# Altium schematic sheet Bias.SchDoc
size B
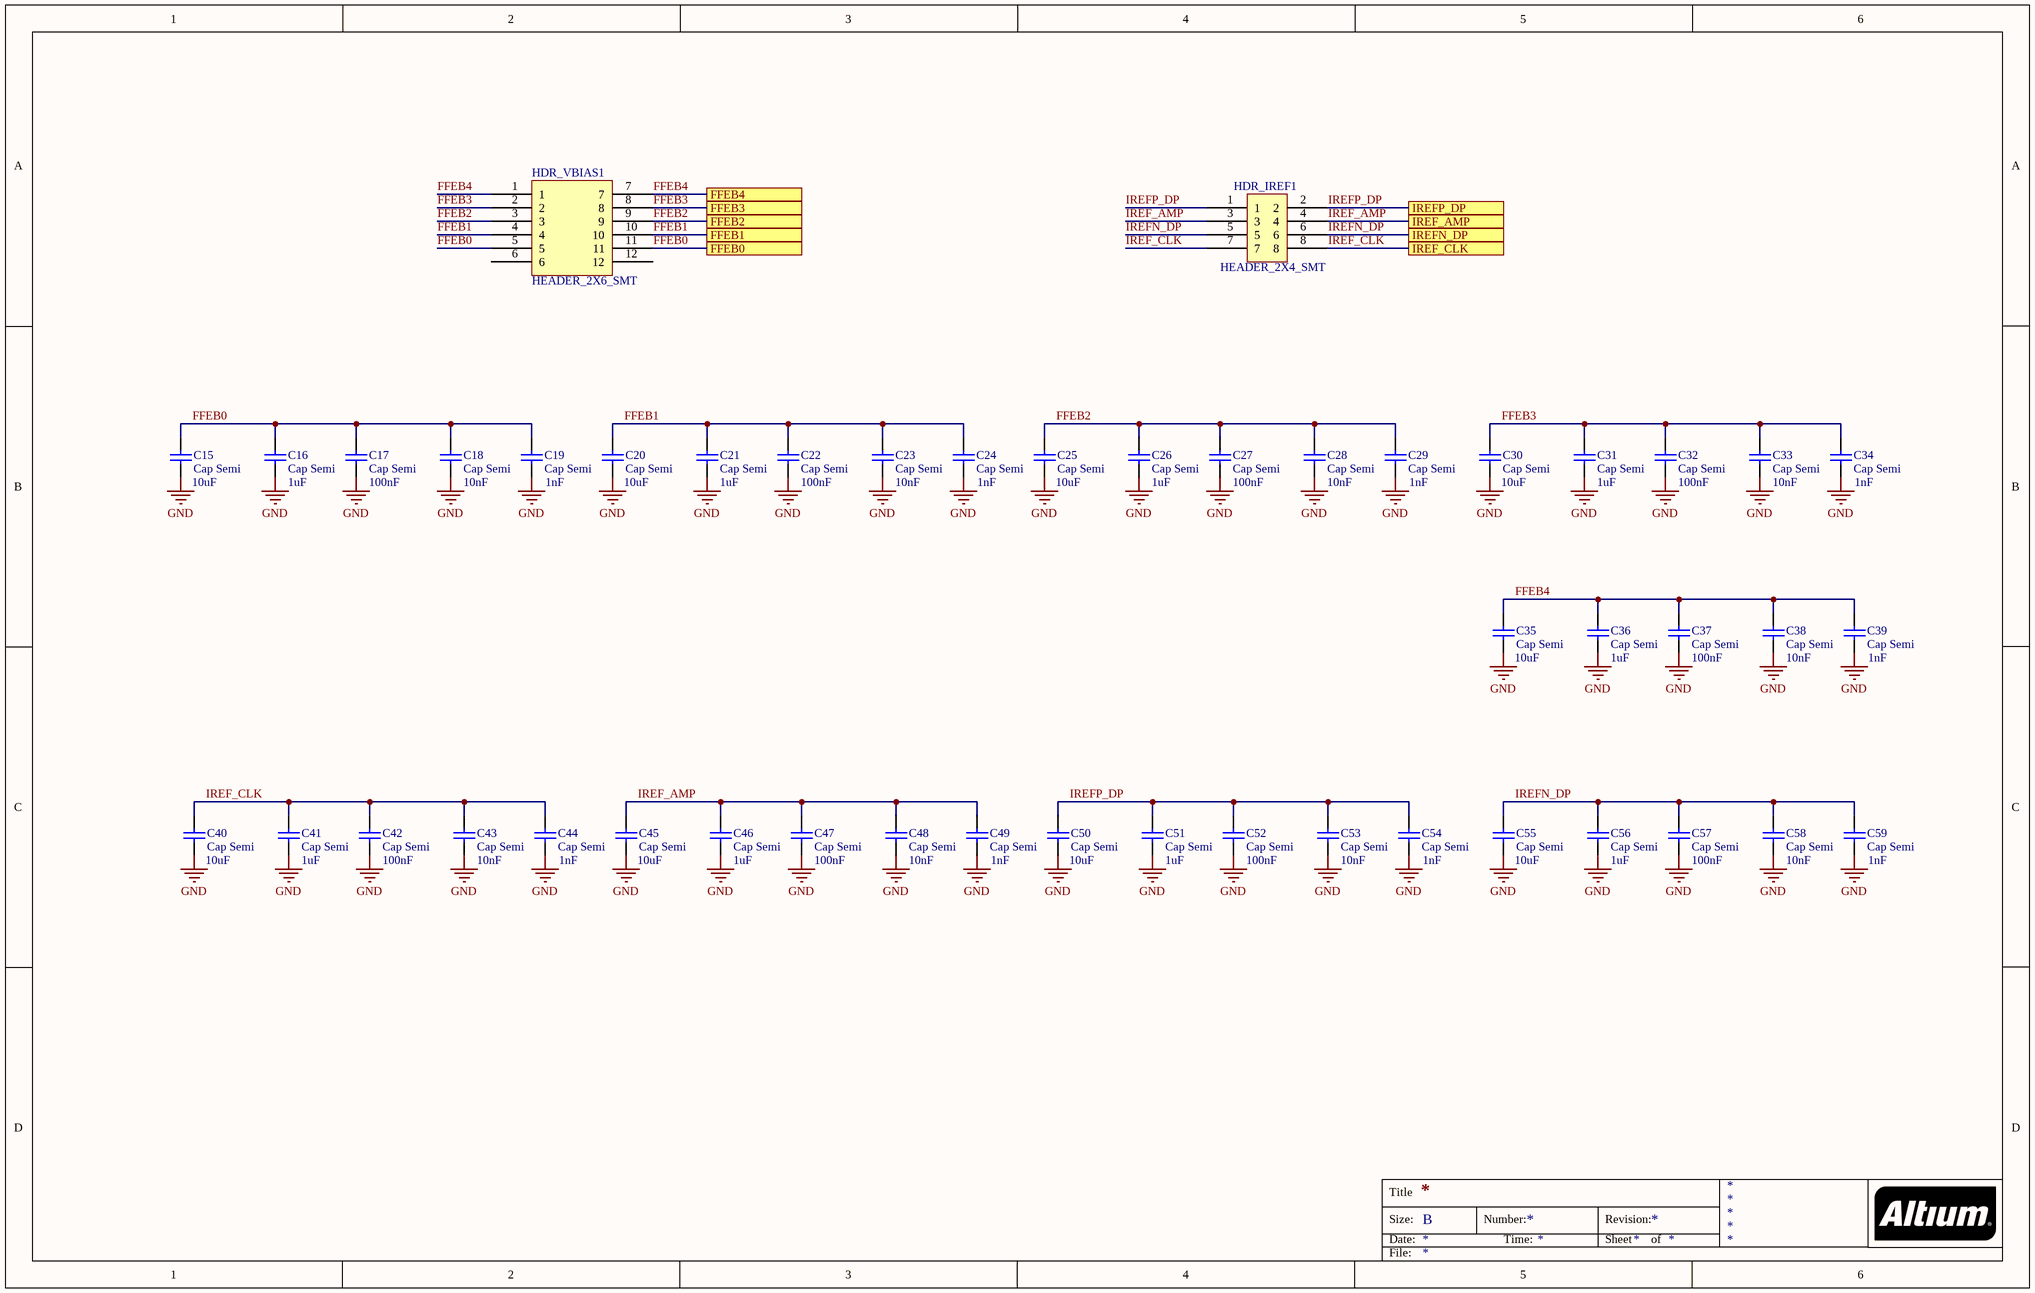
[diagram p0: Bias.SchDoc]

## Parts
C15  Cap Semi  value 10uF  [1608[0603]]
C16  Cap Semi  value 1uF  [1608[0603]]
C17  Cap Semi  value 100nF  [1608[0603]]
C18  Cap Semi  value 10nF  [1608[0603]]
C19  Cap Semi  value 1nF  [1608[0603]]
C20  Cap Semi  value 10uF  [1608[0603]]
C21  Cap Semi  value 1uF  [1608[0603]]
C22  Cap Semi  value 100nF  [1608[0603]]
C23  Cap Semi  value 10nF  [1608[0603]]
C24  Cap Semi  value 1nF  [1608[0603]]
C25  Cap Semi  value 10uF  [1608[0603]]
C26  Cap Semi  value 1uF  [1608[0603]]
C27  Cap Semi  value 100nF  [1608[0603]]
C28  Cap Semi  value 10nF  [1608[0603]]
C29  Cap Semi  value 1nF  [1608[0603]]
C30  Cap Semi  value 10uF  [1608[0603]]
C31  Cap Semi  value 1uF  [1608[0603]]
C32  Cap Semi  value 100nF  [1608[0603]]
C33  Cap Semi  value 10nF  [1608[0603]]
C34  Cap Semi  value 1nF  [1608[0603]]
C35  Cap Semi  value 10uF  [1608[0603]]
C36  Cap Semi  value 1uF  [1608[0603]]
C37  Cap Semi  value 100nF  [1608[0603]]
C38  Cap Semi  value 10nF  [1608[0603]]
C39  Cap Semi  value 1nF  [1608[0603]]
C40  Cap Semi  value 10uF  [1608[0603]]
C41  Cap Semi  value 1uF  [1608[0603]]
C42  Cap Semi  value 100nF  [1608[0603]]
C43  Cap Semi  value 10nF  [1608[0603]]
C44  Cap Semi  value 1nF  [1608[0603]]
C45  Cap Semi  value 10uF  [1608[0603]]
C46  Cap Semi  value 1uF  [1608[0603]]
C47  Cap Semi  value 100nF  [1608[0603]]
C48  Cap Semi  value 10nF  [1608[0603]]
C49  Cap Semi  value 1nF  [1608[0603]]
C50  Cap Semi  value 10uF  [1608[0603]]
C51  Cap Semi  value 1uF  [1608[0603]]
C52  Cap Semi  value 100nF  [1608[0603]]
C53  Cap Semi  value 10nF  [1608[0603]]
C54  Cap Semi  value 1nF  [1608[0603]]
C55  Cap Semi  value 10uF  [1608[0603]]
C56  Cap Semi  value 1uF  [1608[0603]]
C57  Cap Semi  value 100nF  [1608[0603]]
C58  Cap Semi  value 10nF  [1608[0603]]
C59  Cap Semi  value 1nF  [1608[0603]]
HDR_IREF1  HEADER_2X4_SMT  [HEADER_2X4_SMT]
HDR_VBIAS1  HEADER_2X6_SMT  [HDR2X6_SMT]

## Ports
FFEB0, FFEB1, FFEB2, FFEB3, FFEB4, IREF_AMP, IREF_CLK, IREFN_DP, IREFP_DP

## Nets
GND: C15.1 C16.1 C17.1 C18.1 C19.1 C20.1 C21.1 C22.1 C23.1 C24.1 C25.1 C26.1 C27.1 C28.1 C29.1 C30.1 C31.1 C32.1 C33.1 C34.1 C35.1 C36.1 C37.1 C38.1 C39.1 C40.1 C41.1 C42.1 C43.1 C44.1 C45.1 C46.1 C47.1 C48.1 C49.1 C50.1 C51.1 C52.1 C53.1 C54.1 C55.1 C56.1 C57.1 C58.1 C59.1
FFEB0: C15.2 C16.2 C17.2 C18.2 C19.2 HDR_VBIAS1.5 HDR_VBIAS1.11 ; port FFEB0
FFEB1: C20.2 C21.2 C22.2 C23.2 C24.2 HDR_VBIAS1.4 HDR_VBIAS1.10 ; port FFEB1
FFEB2: C25.2 C26.2 C27.2 C28.2 C29.2 HDR_VBIAS1.3 HDR_VBIAS1.9 ; port FFEB2
FFEB3: C30.2 C31.2 C32.2 C33.2 C34.2 HDR_VBIAS1.2 HDR_VBIAS1.8 ; port FFEB3
FFEB4: C35.2 C36.2 C37.2 C38.2 C39.2 HDR_VBIAS1.1 HDR_VBIAS1.7 ; port FFEB4
IREF_AMP: C45.2 C46.2 C47.2 C48.2 C49.2 HDR_IREF1.3 HDR_IREF1.4 ; port IREF_AMP
IREF_CLK: C40.2 C41.2 C42.2 C43.2 C44.2 HDR_IREF1.7 HDR_IREF1.8 ; port IREF_CLK
IREFN_DP: C55.2 C56.2 C57.2 C58.2 C59.2 HDR_IREF1.5 HDR_IREF1.6 ; port IREFN_DP
IREFP_DP: C50.2 C51.2 C52.2 C53.2 C54.2 HDR_IREF1.1 HDR_IREF1.2 ; port IREFP_DP

Not connected (* = marked no-connect by the designer): HDR_VBIAS1 6 12

## Notes on the sheet
- Title
- Size:
- Date:
- B
- Number:
- Time:
- Revision:
- Sheet
- of
- File:

## Library data of the parts
C15-C59 = Cap Semi: Capacitor (Semiconductor SIM Model); Published: 8-Jun-2000; LatestRevisionDate: 29-May-2009; LatestRevisionNote: IPC-7351 Footprint Added.; PackageReference: C1206; Publisher: Altium Limited; PackageDescription: Chip Capacitor